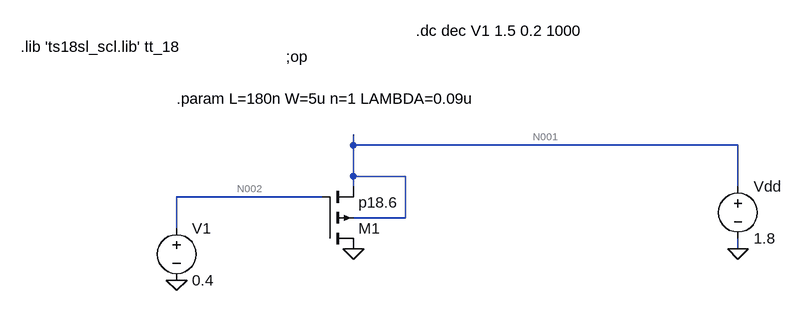
[diagram p0: schematic char-pmos-1.asc]
char-pmos-1.asc, the LTspice schematic file:
Version 4
SHEET 1 1308 704
WIRE 640 224 640 208
WIRE 1232 224 640 224
WIRE 640 272 640 224
WIRE 720 272 640 272
WIRE 640 288 640 272
WIRE 1232 288 1232 224
WIRE 592 304 368 304
WIRE 720 336 720 272
WIRE 720 336 640 336
WIRE 368 352 368 304
WIRE 1232 384 1232 368
FLAG 1232 384 0
FLAG 368 432 0
FLAG 640 384 0
SYMBOL voltage 1232 272 R0
WINDOW 123 0 0 Left 0
WINDOW 39 0 0 Left 0
SYMATTR InstName Vdd
SYMATTR Value 1.8
SYMBOL voltage 368 336 R0
WINDOW 123 0 0 Left 0
WINDOW 39 0 0 Left 0
SYMATTR InstName V1
SYMATTR Value 0.4
SYMBOL pmos4 592 384 M180
SYMATTR InstName M1
SYMATTR Value p18.6
SYMATTR Value2 l=1u w=10u ad={5*W*LAMBDA} as={5*W*LAMBDA} pd={10*LAMBDA+2*W} ps={10*LAMBDA+2*W}
TEXT 128 72 Left 2 !.lib 'ts18sl_scl.lib' tt_18
TEXT 368 152 Left 2 !.param L=180n W=5u n=1 LAMBDA=0.09u
TEXT 536 88 Left 2 !;op
TEXT 736 48 Left 2 !.dc dec V1 1.5 0.2 1000

The netlist it stands for:
* char-pmos-1.asc
Vdd N001 0 1.8
V1 N002 0 0.4
M1 0 N002 N001 N001 p18.6 l=1u w=10u ad={5*W*LAMBDA} as={5*W*LAMBDA} pd={10*LAMBDA+2*W} ps={10*LAMBDA+2*W}
.model NMOS NMOS
.model PMOS PMOS
.lib standard.mos
.lib 'ts18sl_scl.lib' tt_18
.param L=180n W=5u n=1 LAMBDA=0.09u
;op
.dc dec V1 1.5 0.2 1000
.backanno
.end

* Results of the author's LTspice run, read from the files saved beside the schematic
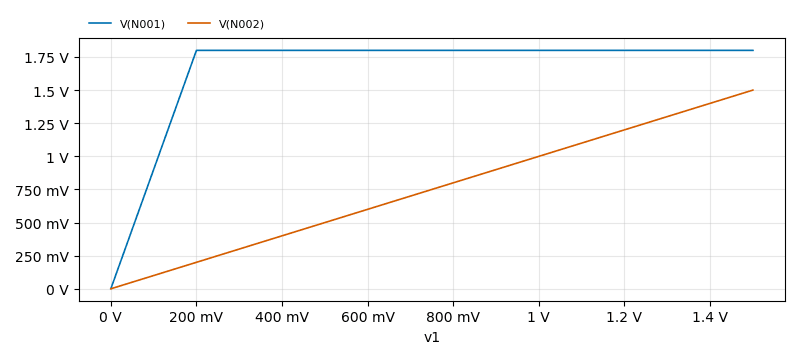
[diagram p1: DC transfer characteristic of char-pmos-1.asc, plotted from the saved traces]
* DC transfer characteristic, 1 run:
*   V(N001): 1.8 V at v1=1.5 V, 0 V at v1=0 V, min 0 V, max 1.8 V
*   V(N002): 1.5 V at v1=1.5 V, 0 V at v1=0 V, min 0 V, max 1.5 V